# Altium project SurfacePressureSensor_V2.PrjPcb
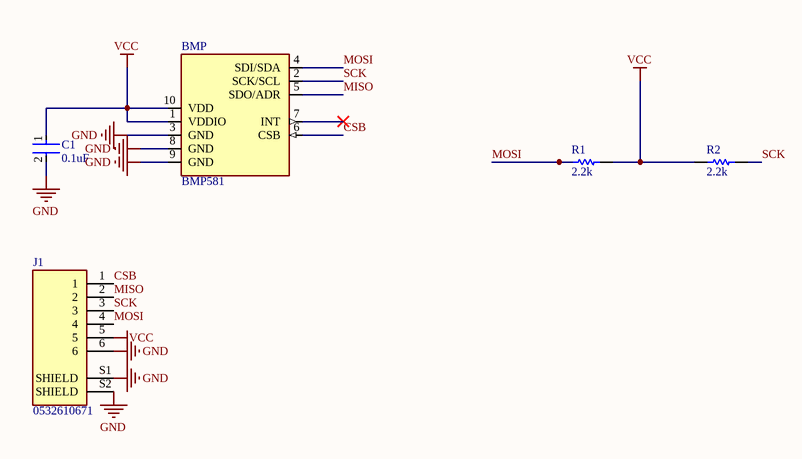
[diagram p0: SurfacePressureSensor_V2.SchDoc]
1 sheet, 5 parts. Net scope: global (net labels, ports and power ports of the same name join across sheets).
Board file: SurfacePressureSensor_V2.PcbDoc

## Sheet SurfacePressureSensor_V2.SchDoc
size A; SheetNumber: 1; SheetTotal: 1

### Parts
BMP  BMP581  [BMP581]
C1  0.1uF  [FP-C0805C-DG-MFG]
J1  0532610671  [MOLEX_0532610671]
R1  2.2k  [RESC2013X50X30LL20T20]
R2  2.2k  [RESC2013X50X30LL20T20]

### Nets
GND: BMP.3(GND) BMP.8(GND) BMP.9(GND) C1.2 J1.6 J1.S1(SHIELD) J1.S2(SHIELD)
VCC: BMP.1(VDDIO) BMP.10(VDD) C1.1 J1.5 R1.2 R2.1
CSB: BMP.6(CSB) J1.1
MISO: BMP.5(SDO/ADR) J1.2
MOSI: BMP.4(SDI/SDA) J1.4 R1.1
SCK: BMP.2(SCK/SCL) J1.3 R2.2

Not connected (* = marked no-connect by the designer): BMP 7(INT)*

### Library data of the parts
BMP = BMP581: Very small, low-power and low noise 24-bit absolute barometric pressure sensor. This digital, high-performance sensor is ideally suited for a wide range of altitude tracking applications and offers outstanding design flexibility; MF: Bosch; Purchase-URL: https://pricing.snapeda.com/search/part/BMP581/?ref=eda; Value: *; Package: None; Availability: In Stock; SnapEDA_Link: https://www.snapeda.com/parts/BMP581/Bosch/view-part/?ref=snap; MP: BMP581; Check_prices: https://www.snapeda.com/parts/BMP581/Bosch/view-part/?ref=eda; Price: None
C1 = CMP-2007-03243-2: CAP CER 10UF 10V X5R 0805; Manufacturer Part Number: C0805C106K8PACTU; Manufacturer: Kemet; 3DS Part Number: 220-00001; Tolerance: 10%; Temperature Coefficient: 15%; Material: Ceramic; Device Class L2: Capacitors; Device Class L1: Passive Components; ComponentLink2URL: https://content.kemet.com/datasheets/KEM_C1006_X5R_SMD.pdf; Height: 1.4mm; Lead Free: Yes; Digikey Description: CAP CER 10UF 10V X5R 0805; Octopart: https://octopart.com/c0805c106k8pactu-kemet-98697; Capacitance: 10uF; Value: 10uF; Temperature Range Low: -55°C; Temperature: -55°C to +85°C; Automotive: No; Mouser Description: CAP CER 10UF 10V X5R 0805; Ipc Land Pattern Name: CAPC200125X125; Temperature Range High: +85°C; Voltage: 10V; RoHS: TRUE; Device Class L3: Ceramic Capacitors; ComponentLink2Description: Datasheet; Voltage Rating: 10V; Package: C0805C-DG; Temperature Characteristic: X5R; Category: Cap
J1 = 0532610671: Picoblade Connector, 6 Circuit Single Row, Right Angle Surface Mount SMT PCB; MF: Molex; SnapEDA_Link: https://www.snapeda.com/parts/0532610671/Molex/view-part/523089/?ref=snap; Package: None; Value: *; MP: 0532610671; Digi-Key_Part_Number: WM7624CT-ND; Digi-Key_Purchase_URL: https://www.digikey.com/product-detail/en/molex/0532610671/WM7624CT-ND/699111?utm_source=snapeda&utm_medium=aggregator&utm_campaign=symbol
R1 R2 = CMP-2001-04896-1: Manufacturer: Vishay Dale; Part Number: CRCW08050000Z0EA